# Altium schematic sheet Vreg.SchDoc
size A
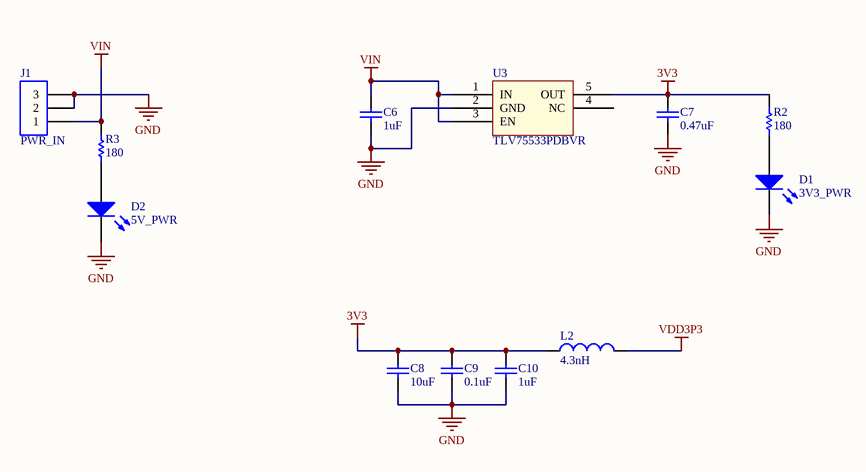
[diagram p0: Vreg.SchDoc]

## Parts
C6  1uF  [C0805]
C7  0.47uF  [CAPC1608X90X35ML15T15]
C8  10uF  [PCB-3l8viaoeo84t9gm70k7i-1]
C9  0.1uF  [PCB-oygqt4xf3sesynjclq4r-1]
C10  1uF  [C0805]
D1  3V3_PWR  [PCB-1544848-1]
D2  5V_PWR  [DIOM1608X06N]
J1  PWR_IN  [ADAM-ADC-002-3_V]
L2  4.3nH  [PCB-vetezry5jn2cqs6s1af8-1]
R2  180  [RESC2013X60X30NL20T20]
R3  180  [RESC2013X60X30NL20T20]
U3  TLV75533PDBVR  [PCB-9xapb279xxlk04njnstk-1]

## Nets
3V3: C7.2 C8.2 C9.2 C10.1 L2.1 R2.2 U3.5(OUT)
GND: C6.2 C7.1 C8.1 C9.1 C10.2 D1.2(K) D2.K J1.2 J1.3 U3.2(GND)
VDD3P3: L2.2
VIN: C6.1 J1.1 R3.2 U3.1(IN) U3.3(EN)
NetD1_1: D1.1(A) R2.1
NetD2_A: D2.A R3.1

Not connected (* = marked no-connect by the designer): U3 4(NC)

## Library data of the parts
C6 C10 = CMP-77c3bc4dc880a804-3: 0805 1 uF 25 V ±10 % Tolerance X7R SMT Multilayer Ceramic Capacitor; Manufacturer Part Number: CC0805KKX7R8BB105; Lead-Free Status: Lead Free; Voltage Rating (DC): 25.0 V; Capacitance Tolerance: ±10%; Octopart Url: http://octopart.com/cc0805kkx7r8bb105-yageo-42244645; Seller Landing  Url: https://octopart-clicks.com/click/track?country=US&ak=8157f166&sig=04b9cde&sid=5489&ppid=42244645&vpid=127579773&ct=offers; Number of Pins: 2; Mounting Style: Surface Mount; Packaging: Cut Tape (CT); Case/Package: 0805; REACH SVHC Compliance: No SVHC; RoHS: Compliant; Halogen Free Status: Halogen Free; Capacitance: 1uF; OctopartID: 77c3bc4dc880a804; Dielectric Characteristic: X7R
C7 = CMP-55ff9c78cd6f8a38-1: CL10 Series 0.47 uF 16 V ±10 % Tolerance X7R SMT Multilayer Ceramic Capacitor; RoHS: Compliant
C8 = CMP-5e7a9647d7d381bd-6: Cap Ceramic 10uF 25V X5R 10% SMD 0805 85C Paper T/R; Manufacturer Part Number: TMK212BBJ106KG-T; Octopart URL: http://octopart.com/tmk212bbj106kg-t-taiyo+yuden-20425935; Dielectric Characteristic: X5R
C9 = CMP-2758844-5: 0.1uF, ±10%, 50V, X7R, 0805, Multilayer Ceramic Capacitor; Manufacturer Part Number: CL21B104KBCNNNC; Lead-Free Status: Lead Free; Voltage Rating (DC): 50.0 V; Capacitance: 100 nF; Operating Temperature: -55.0 °C (min); RoHS: Compliant; Octopart URL: https://octopart.com/cl21b104kbcnnnc-samsung-9299352; Mounting Style: Surface Mount; Case/Package: 0805; Dielectric Characteristic: X7R; OctopartID: 94265da154d84be1
D1 = CMP-1f66d74e5acac0a1-1: Blue 1.6 x 0.8 x 0.3 mm 130° Clear 180 mcd 3.8 V Surface Mount LED; Manufacturer Part Number: LTST-C194TBKT; Lead-Free Status: Lead Free; Case/Package: 0603; Packaging: Reel
D2 = CMP-1544848-9: LED; SMD; 0603; red; 18-54mcd; 1.6x0.8x0.55mm; 130°; 2÷2.4V; 20mA; Wavelength: 639 nm; Case/Package (SI): 1608; Luminous Intensity: 54.0 mcd; Lead-Free Status: Lead Free; Color: Red; RoHS: Compliant; Packaging: Tape & Reel (TR), Cut Tape (CT); Operating Temperature: 85.0 °C (max); Mounting Style: Surface Mount, Vertical; Viewing Angle: 130 °; Size-Height: 550 µm
J1 = CMP-3153101-9: DC Power Connectors DC POWER JACK 2.5MM PIN TYPE 002; Manufacturer Part Number: ADC-002-2; Octopart Url: https://octopart.com/adc-002-2-adam+tech-55509430; OctopartID: 975d5d18b38d489a; Orientation: Right Angle
L2 = CMP-e5012c7543d03ac6-1: Surface Mount High Frequency Inductor, LQW15AN Series, 4.3 nH, 0.1nH, 0402 [1005 Metric], 10 GHz; Manufacturer Part Number: LQW15AN4N3B00D; Lead-Free Status: Lead Free; Inductance: 4.30 nH; Lifecycle Status: Active; Octopart URL: http://octopart.com/lqw15an4n3b00d-murata-8291255; Packaging: Cut Tape (CT); Case/Package: 0402, 1005; RoHS: Compliant; REACH SVHC Compliance: No SVHC; OctopartID: e5012c7543d03ac6
R2 R3 = CMP-3657049-2: Thick Film Resistors - SMD 1/8watts 180ohms 1%; Manufacturer Part Number: RK73H2ATTD1800F; Lead-Free Status: Lead Free; Power Rating: 0.125 W; Resistance: 180.0 Ω; Case/Package: 0805; Mounting Style: Surface Mount; Octopart Url: https://octopart.com/rk73h2attd1800f-koa+speer-15007961; OctopartID: af1966f68aa670de; Resistance Tolerance: ±1%; RoHS: Compliant
U3 = CMP-a508697234f37acf-1: 500-mA low-IQ small-size low-dropout (LDO) regulator 5-SOT-23 -40 to 125; Quiescent Current: 25.0 µA; Output Capacitor Type: Ceramic; Dropout Voltage: 220 mV; Number of Regulated Outputs: 1; Case/Package: SOT-23; Lifecycle Status: Pre-Release; Octopart URL: https://octopart.com/tlv75533pdbvr-texas+instruments-91272349; OctopartID: a508697234f37acf; Operating Temperature: -40.0 °C to 125 °C; RoHS: Compliant; Number of Pins: 5; Manufacturer Part Number: TLV75533PDBVR